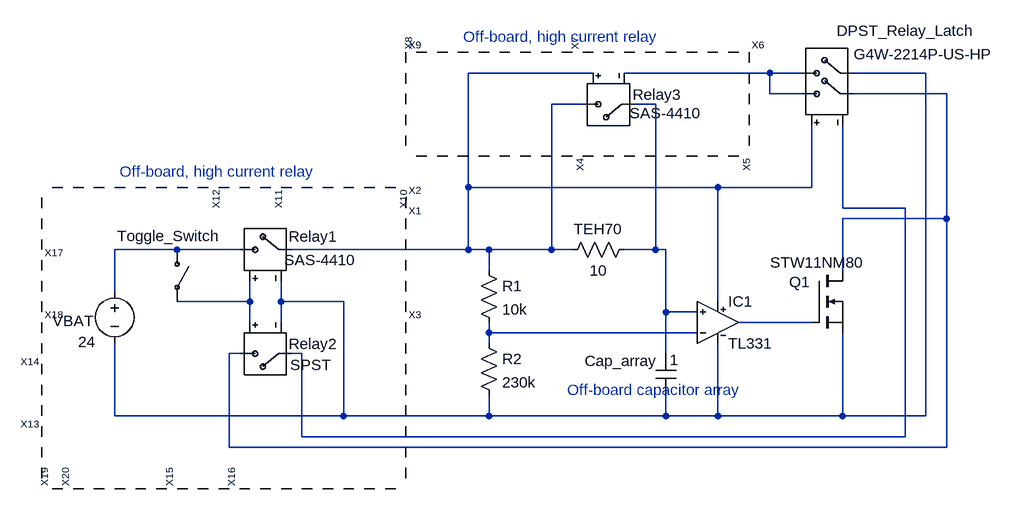
[diagram p0: schematic RTx_Charger.asc]
RTx_Charger.asc, the LTspice schematic file:
Version 4
SHEET 1 1356 788
WIRE 304 -192 112 -192
WIRE 576 -192 352 -192
WIRE 624 -192 576 -192
WIRE 816 -192 704 -192
WIRE 576 -160 576 -192
WIRE 624 -160 576 -160
WIRE 848 -160 704 -160
WIRE 288 -144 240 -144
WIRE 400 -144 368 -144
WIRE 112 -16 112 -192
WIRE 496 -16 112 -16
WIRE 640 -16 640 -112
WIRE 640 -16 496 -16
WIRE 688 16 688 -112
WIRE 784 16 688 16
WIRE 848 32 848 -160
WIRE 848 32 688 32
WIRE -336 80 -432 80
WIRE -240 80 -336 80
WIRE 112 80 112 -16
WIRE 112 80 -160 80
WIRE 144 80 112 80
WIRE 240 80 240 -144
WIRE 240 80 144 80
WIRE 272 80 240 80
WIRE 400 80 400 -144
WIRE 400 80 352 80
WIRE 416 80 400 80
WIRE 144 112 144 80
WIRE 688 112 688 32
WIRE -432 144 -432 80
WIRE -224 160 -224 128
WIRE -224 160 -336 160
WIRE -176 160 -176 128
WIRE -80 160 -176 160
WIRE 496 160 496 -16
WIRE 416 176 416 80
WIRE 464 176 416 176
WIRE -224 192 -224 160
WIRE -176 192 -176 160
WIRE 640 192 528 192
WIRE 144 208 144 192
WIRE 464 208 144 208
WIRE 144 224 144 208
WIRE -240 240 -256 240
WIRE -144 240 -160 240
WIRE 416 240 416 176
WIRE -432 336 -432 224
WIRE -80 336 -80 160
WIRE -80 336 -432 336
WIRE 144 336 144 304
WIRE 144 336 -80 336
WIRE 416 336 416 304
WIRE 416 336 144 336
WIRE 496 336 496 224
WIRE 496 336 416 336
WIRE 688 336 688 208
WIRE 688 336 496 336
WIRE 816 336 816 -192
WIRE 816 336 688 336
WIRE -144 368 -144 240
WIRE 784 368 784 16
WIRE 784 368 -144 368
WIRE -256 384 -256 240
WIRE 848 384 848 32
WIRE 848 384 -256 384
SYMBOL cap 400 240 R0
WINDOW 0 -109 11 Left 2
WINDOW 3 22 10 Left 2
SYMATTR InstName Cap_array
SYMATTR Value 1
SYMBOL voltage -432 128 R0
WINDOW 123 0 0 Left 2
WINDOW 39 0 0 Left 2
WINDOW 0 -95 62 Left 2
WINDOW 3 -56 94 Left 2
SYMATTR InstName VBAT
SYMATTR Value 24
SYMBOL res 256 96 R270
WINDOW 0 32 56 VTop 2
WINDOW 3 0 56 VBottom 2
SYMATTR InstName TEH70
SYMATTR Value 10
SYMBOL res 128 96 R0
SYMATTR InstName R1
SYMATTR Value 10k
SYMBOL res 128 208 R0
SYMATTR InstName R2
SYMATTR Value 230k
SYMBOL nmos 640 112 R0
WINDOW 0 -2 18 Right 2
WINDOW 3 81 -12 Right 2
SYMATTR InstName Q1
SYMATTR Value STW11NM80
SYMBOL csw -336 80 R0
WINDOW 0 -92 -21 Left 2
SYMATTR InstName Toggle_Switch
SYMATTR Value ""
SYMBOL dashed_line 16 368 R0
SYMATTR InstName X3
SYMBOL dashed_line 96 -64 R90
SYMATTR InstName X4
SYMBOL dashed_line 352 -64 R90
SYMATTR InstName X5
SYMBOL dashed_line 464 -224 R270
SYMATTR InstName X7
SYMBOL dashed_line 208 -224 R270
SYMATTR InstName X8
SYMBOL dashed_line -176 -16 R90
SYMATTR InstName X10
SYMBOL dashed_line -368 -16 R90
SYMATTR InstName X11
SYMBOL dashed_line -464 -16 R90
SYMATTR InstName X12
SYMBOL dashed_line -544 160 R180
SYMATTR InstName X13
SYMBOL dashed_line -544 64 R180
SYMATTR InstName X14
SYMBOL dashed_line -160 448 R270
SYMATTR InstName X15
SYMBOL dashed_line -64 448 R270
SYMATTR InstName X16
SYMBOL dashed_line -544 272 R0
SYMATTR InstName X17
SYMBOL dashed_line -544 368 R0
SYMATTR InstName X18
SYMBOL dashed_line -352 448 R270
SYMATTR InstName X19
SYMBOL dashed_line -320 448 R270
SYMATTR InstName X20
SYMBOL dashed_line2 544 -144 R0
SYMATTR InstName X6
SYMBOL dashed_line2 16 112 R0
SYMATTR InstName X1
SYMBOL dashed_line2 16 80 R0
SYMATTR InstName X2
SYMBOL dashed_line2 16 -144 R0
SYMATTR InstName X9
SYMBOL TL331 496 192 R0
SYMATTR InstName IC1
SYMBOL Relay 720 -160 M270
WINDOW 0 97 41 VLeft 2
WINDOW 3 61 15 VLeft 2
SYMATTR InstName DPST_Relay_Latch
SYMATTR Value G4W-2214P-US-HP
SYMBOL Relay2 -192 96 M0
WINDOW 0 -103 -36 Left 2
WINDOW 3 -130 0 Left 2
SYMATTR InstName Relay1
SYMATTR Value SAS-4410
SYMBOL Relay2 336 -160 R180
WINDOW 0 -104 -1 Left 2
WINDOW 3 -134 -30 Left 2
SYMATTR InstName Relay3
SYMATTR Value SAS-4410
SYMBOL Relay2 -192 224 R180
WINDOW 0 -103 -1 Left 2
WINDOW 3 -92 -33 Left 2
SYMATTR InstName Relay2
TEXT 104 -248 Left 2 ;Off-board, high current relay
TEXT -424 -40 Left 2 ;Off-board, high current relay
TEXT 264 296 Left 2 ;Off-board capacitor array

The netlist it stands for:
* RTx_Charger.asc
Cap_array N005 N003 1
VBAT N007 N003 24
R§TEH70 N001 N005 10
R1 N001 N010 10k
R2 N010 N003 230k
M§Q1 N004 N009 N003 N003 STW11NM80
W§Toggle_Switch N007 N008
XX3 dashed_line
XX4 dashed_line
XX5 dashed_line
XX7 dashed_line
XX8 dashed_line
XX10 dashed_line
XX11 dashed_line
XX12 dashed_line
XX13 dashed_line
XX14 dashed_line
XX15 dashed_line
XX16 dashed_line
XX17 dashed_line
XX18 dashed_line
XX19 dashed_line
XX20 dashed_line
XX6 dashed_line2
XX1 dashed_line2
XX2 dashed_line2
XX9 dashed_line2
XIC1 N010 N005 N001 N003 N009 LT1018  ; pins In+ In- V+ V- OUT
S§DPST_Relay_Latch N004 N002 N001 N006 N003 N002 G4W-2214P-US-HP
S§Relay1 N001 N007 N008 N003 SAS-4410
S§Relay3 N005 N001 N001 N002 SAS-4410
S§Relay2 N006 N004 N008 N003 SPST
.model NMOS NMOS
.model PMOS PMOS
.lib standard.mos
* Off-board, high current relay
* Off-board, high current relay
* Off-board capacitor array
.lib LTC1.lib
.backanno
.end